# EAGLE schematic motor (EAGLE 6.6.0)
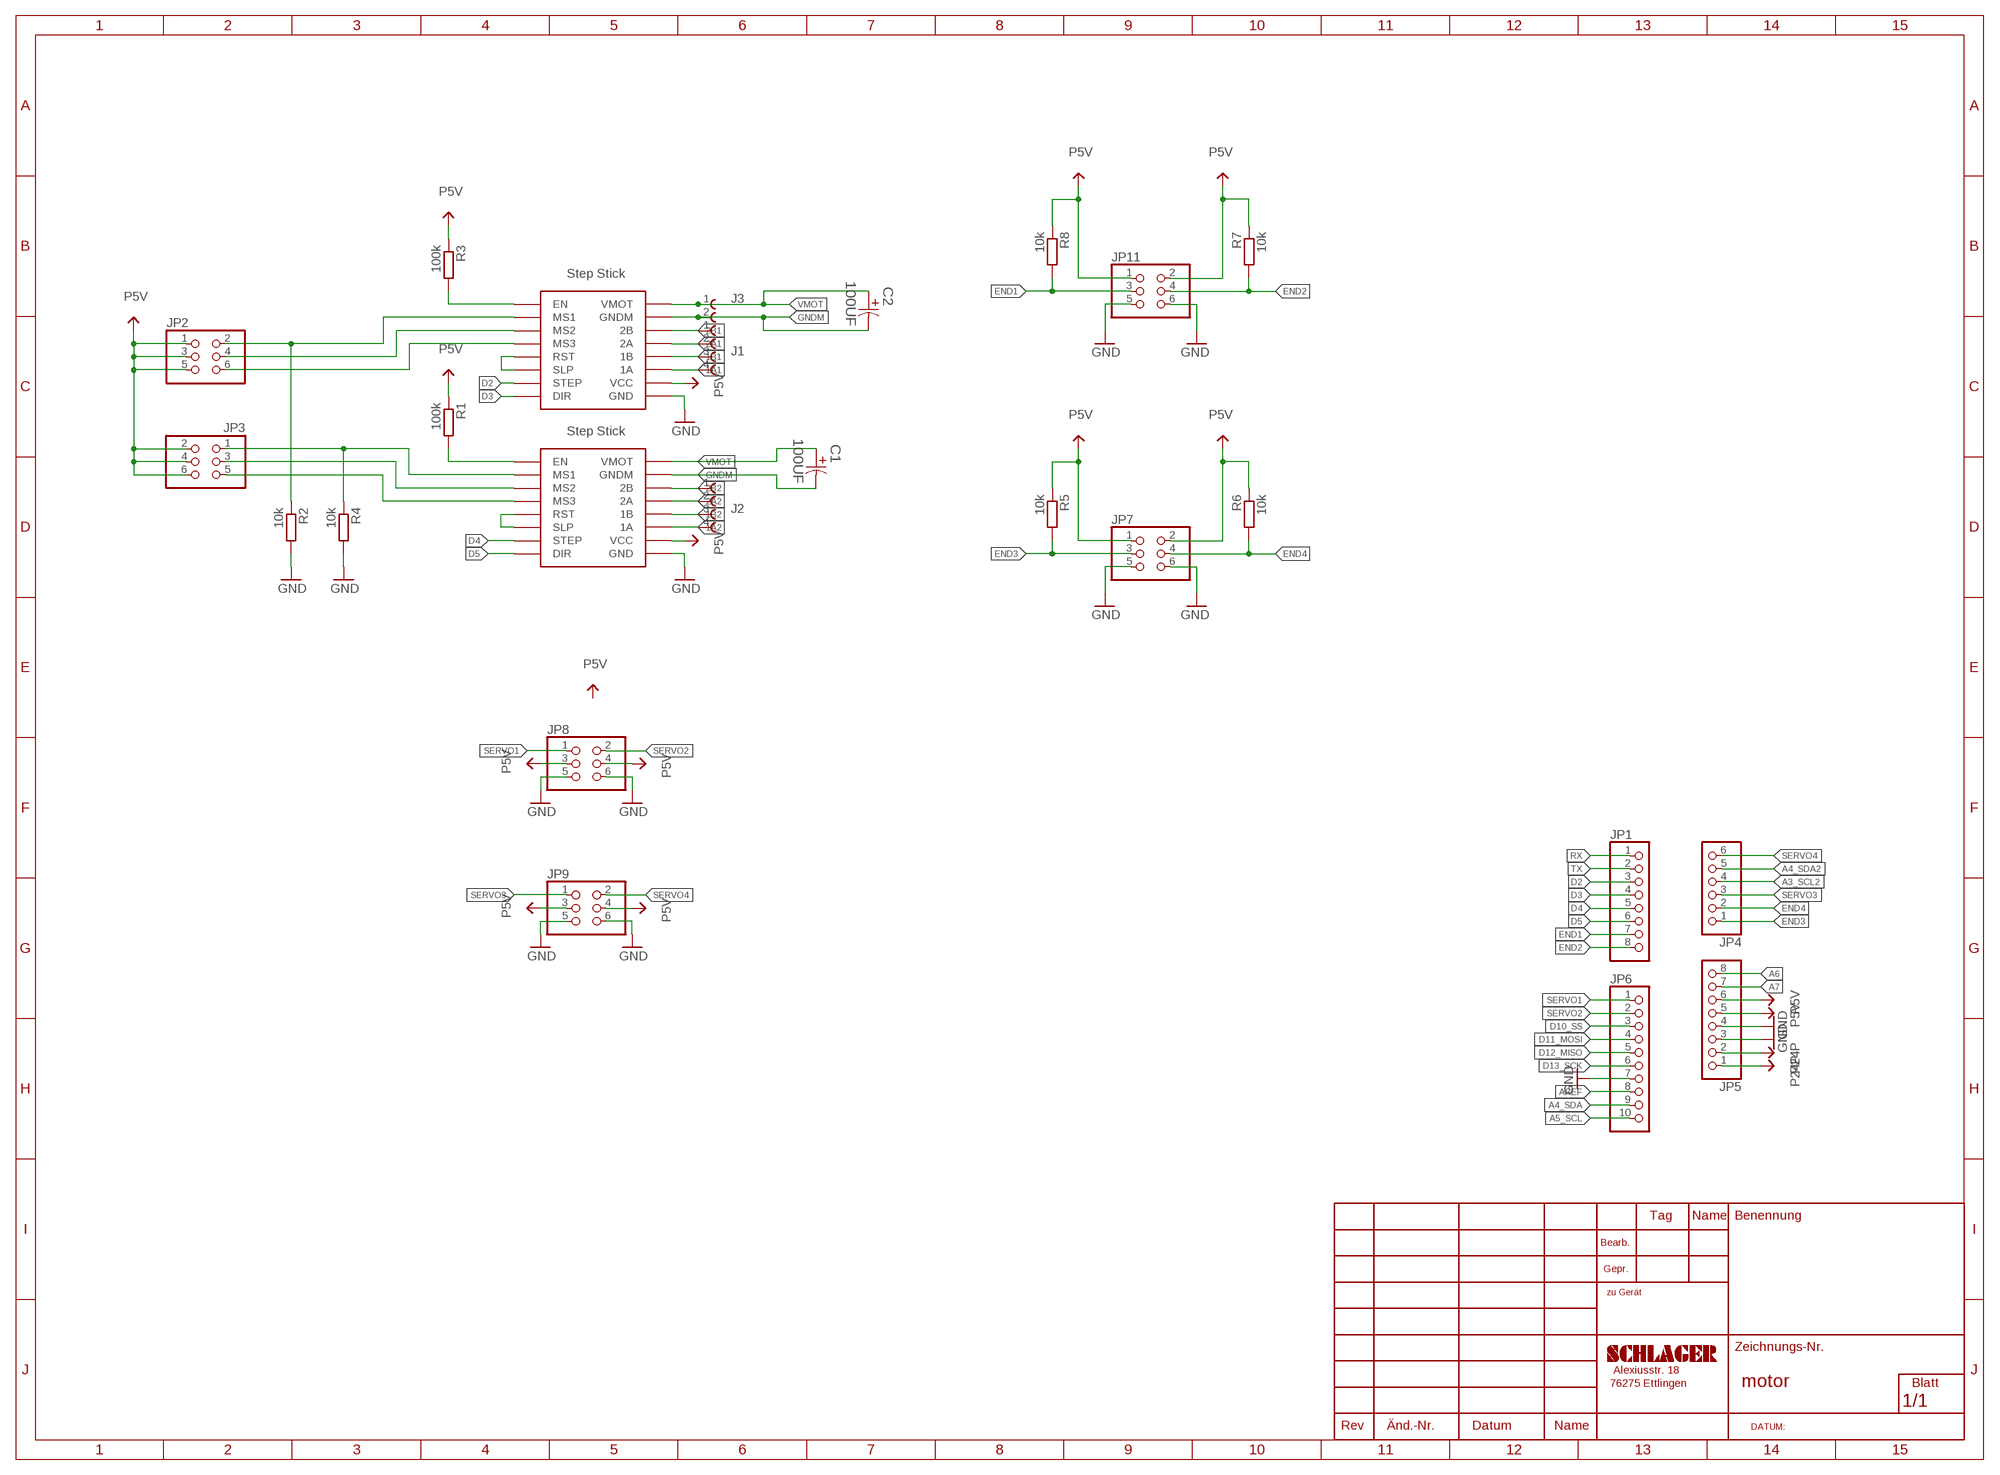
[diagram p0: schematic, sheet 1]

## Parts
C1  100UF  EEE-FK1V101P-CASE-F  [CAPAE830X1050N]
C2  100UF  EEE-FK1V101P-CASE-F  [CAPAE830X1050N]
J1  691312510004  [691312510004]
J2  691312510004  [691312510004]
J3  691312510002  [691312510002]
JP1  PINHD-1X8  [1X08]
JP2  PINHD-2X3  [2X03]
JP3  PINHD-2X3  [2X03]
JP4  PINHD-1X6  [1X06]
JP5  PINHD-1X8  [1X08]
JP6  PINHD-1X10  [1X10]
JP7  PINHD-2X3/90  [2X03/90]
JP8  PINHD-2X3/90  [2X03/90]
JP9  PINHD-2X3/90  [2X03/90]
JP11  PINHD-2X3/90  [2X03/90]
R1  100k  R-EU_R0805  [R0805]
R2  10k  R-EU_R0805  [R0805]
R3  100k  R-EU_R0805  [R0805]
R4  10k  R-EU_R0805  [R0805]
R5  10k  R-EU_R0805  [R0805]
R6  10k  R-EU_R0805  [R0805]
R7  10k  R-EU_R0805  [R0805]
R8  10k  R-EU_R0805  [R0805]
U$1  STEP-STICK  [STEP-STICK]
U$2  STEP-STICK  [STEP-STICK]

## Nets
1A1: J1.4 U$2.1A
1A2: J2.4 U$1.1A
1B1: J1.3 U$2.1B
1B2: J2.3 U$1.1B
2A1: J1.2 U$2.2A
2A2: J2.2 U$1.2A
2B1: J1.1 U$2.2B
2B2: J2.1 U$1.2B
A3_SCL2: JP4.4
A4_SDA: JP6.9
A4_SDA2: JP4.5
A5_SCL: JP6.10
A6: JP5.8
A7: JP5.7
AREF: JP6.8
D2: JP1.3 U$2.SPT(STEP)
D3: JP1.4 U$2.DIR
D4: JP1.5 U$1.SPT(STEP)
D5: JP1.6 U$1.DIR
D10_SS: JP6.3
D11_MOSI: JP6.4
D12_MISO: JP6.5
D13_SCK: JP6.6
END1: JP1.7 JP11.3 R8.2
END2: JP1.8 JP11.4 R7.2
END3: JP4.1 JP7.3 R5.2
END4: JP4.2 JP7.4 R6.2
GND: JP5.3 JP5.4 JP6.7 JP7.5 JP7.6 JP8.5 JP8.6 JP9.5 JP9.6 JP11.5 JP11.6 R2.2 R4.2 U$1.GND U$2.GND
GNDM: C1.2 C2.2 J3.2 U$1.GNDM U$2.GNDM
N$1: JP2.2 R2.1 U$2.MS1
N$2: JP2.4 U$2.MS2
N$3: JP2.6 U$2.MS3
N$4: JP3.1 R4.1 U$1.MS1
N$5: JP3.3 U$1.MS2
N$6: JP3.5 U$1.MS3
N$7: R1.2 U$1.EN
N$8: U$2.RST U$2.SLP
N$9: R3.2 U$2.EN
N$10: U$1.RST U$1.SLP
P5V: JP2.1 JP2.3 JP2.5 JP3.2 JP3.4 JP3.6 JP5.5 JP5.6 JP7.1 JP7.2 JP8.3 JP8.4 JP9.3 JP9.4 JP11.1 JP11.2 R1.1 R3.1 R5.1 R6.1 R7.1 R8.1 U$1.VCC U$2.VCC
P24P: JP5.1 JP5.2
RX: JP1.1
SERVO1: JP6.1 JP8.1
SERVO2: JP6.2 JP8.2
SERVO3: JP4.3 JP9.1
SERVO4: JP4.6 JP9.2
TX: JP1.2
VMOT: C1.1 C2.1 J3.1 U$1.VMOT U$2.VMOT

## Library data of the parts
C1 C2 = PASSIV_Panasonic-EEEFK_EEEFP:EEE-: Aluminum Electrolytic Capacitors,Surface Mount Type; MPN: EEE-FK1V101P; OC_FARNELL: 9695869; OC_NEWARK: 82K7638; PACKAGE: CASE-F; SUPPLIER: PANASONIC; TOLERANCE: ±20 %; VOLTAGERATING: 35V
J1 J2 = Eagle_TERMINAL_BLOCKS_rev16a:691312510004: WR-TBL Serie 312 - 5.08 mm Open Horizontal PCB Header , 4 Pins=>Code : Con_TBL_Pluggable_5.08_PCB_THT_Simple_H_691312510004 <http://katalog.we-online.de/media/images/eican/Con_TBL_Pluggable_5.08_PCB_THT_Simple_H_6913125100xx_pf2.jpg> Details see: http://katalog.we-online.de/en/em/691_312_510_0xx Created 2014-06-25, Karrer Zheng 2014 (C) Würth Elektronik
J3 = Eagle_TERMINAL_BLOCKS_rev16a:691312510002: WR-TBL Serie 312 - 5.08 mm Open Horizontal PCB Header , 2 Pins=>Code : Con_TBL_Pluggable_5.08_PCB_THT_Simple_H_691312510002 <http://katalog.we-online.de/media/images/eican/Con_TBL_Pluggable_5.08_PCB_THT_Simple_H_6913125100xx_pf2.jpg> Details see: http://katalog.we-online.de/en/em/691_312_510_0xx Created 2014-06-25, Karrer Zheng 2014 (C) Würth Elektronik
JP1 JP5 = pinhead:PINHD-1X8: PIN HEADER
JP2 JP3 JP7-JP9 JP11 = pinhead:PINHD-2X3: PIN HEADER
JP4 = pinhead:PINHD-1X6: PIN HEADER
JP6 = pinhead:PINHD-1X10: PIN HEADER
R1-R8 = schlager_passiv:R-EU_: RESISTOR, European symbol
U$1 U$2 = Arduino-clone:STEP-STICK

## Net classes
4 USBpair: width 0.254 mm, drill 0.406 mm, clearance 0.508 mm